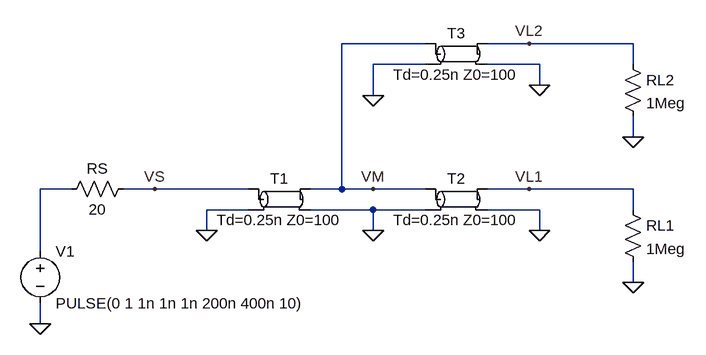
[diagram p0: schematic dualTrace.asc]
dualTrace.asc, the LTspice schematic file:
Version 4
SHEET 1 1128 680
WIRE 720 -160 592 -160
WIRE 880 -160 816 -160
WIRE 1040 -160 880 -160
WIRE 720 -128 640 -128
WIRE 896 -128 816 -128
WIRE 1040 -128 1040 -160
WIRE 896 -96 896 -128
WIRE 640 -80 640 -128
WIRE 1040 -16 1040 -48
WIRE 176 64 128 64
WIRE 304 64 256 64
WIRE 448 64 304 64
WIRE 592 64 592 -160
WIRE 592 64 544 64
WIRE 640 64 592 64
WIRE 720 64 640 64
WIRE 880 64 816 64
WIRE 1040 64 880 64
WIRE 448 96 384 96
WIRE 640 96 544 96
WIRE 720 96 640 96
WIRE 896 96 816 96
WIRE 1040 96 1040 64
WIRE 384 128 384 96
WIRE 640 128 640 96
WIRE 896 128 896 96
WIRE 128 160 128 64
WIRE 1040 208 1040 176
WIRE 128 272 128 240
FLAG 128 272 0
FLAG 384 128 0
FLAG 640 128 0
FLAG 896 128 0
FLAG 1040 208 0
FLAG 304 64 VS
FLAG 640 64 VM
FLAG 880 64 VL1
FLAG 896 -96 0
FLAG 1040 -16 0
FLAG 880 -160 VL2
FLAG 640 -80 0
SYMBOL voltage 128 144 R0
WINDOW 123 0 0 Left 0
WINDOW 39 0 0 Left 0
SYMATTR InstName V1
SYMATTR Value PULSE(0 1 1n 1n 1n 200n 400n 10)
SYMBOL tline 496 80 R0
SYMATTR InstName T1
SYMATTR Value Td=0.25n Z0=100
SYMBOL tline 768 80 R0
SYMATTR InstName T2
SYMATTR Value Td=0.25n Z0=100
SYMBOL res 1024 80 R0
SYMATTR InstName RL1
SYMATTR Value 1Meg
SYMBOL res 272 48 R90
WINDOW 0 0 56 VBottom 2
WINDOW 3 32 56 VTop 2
SYMATTR InstName RS
SYMATTR Value 20
SYMBOL tline 768 -144 R0
SYMATTR InstName T3
SYMATTR Value Td=0.25n Z0=100
SYMBOL res 1024 -144 R0
SYMATTR InstName RL2
SYMATTR Value 1Meg

The netlist it stands for:
* dualTrace.asc
V1 N001 0 PULSE(0 1 1n 1n 1n 200n 400n 10)
T1 VS 0 VM 0 Td=0.25n Z0=100
T2 VM 0 VL1 0 Td=0.25n Z0=100
RL1 VL1 0 1Meg
RS VS N001 20
T3 VM 0 VL2 0 Td=0.25n Z0=100
RL2 VL2 0 1Meg
.backanno
.end